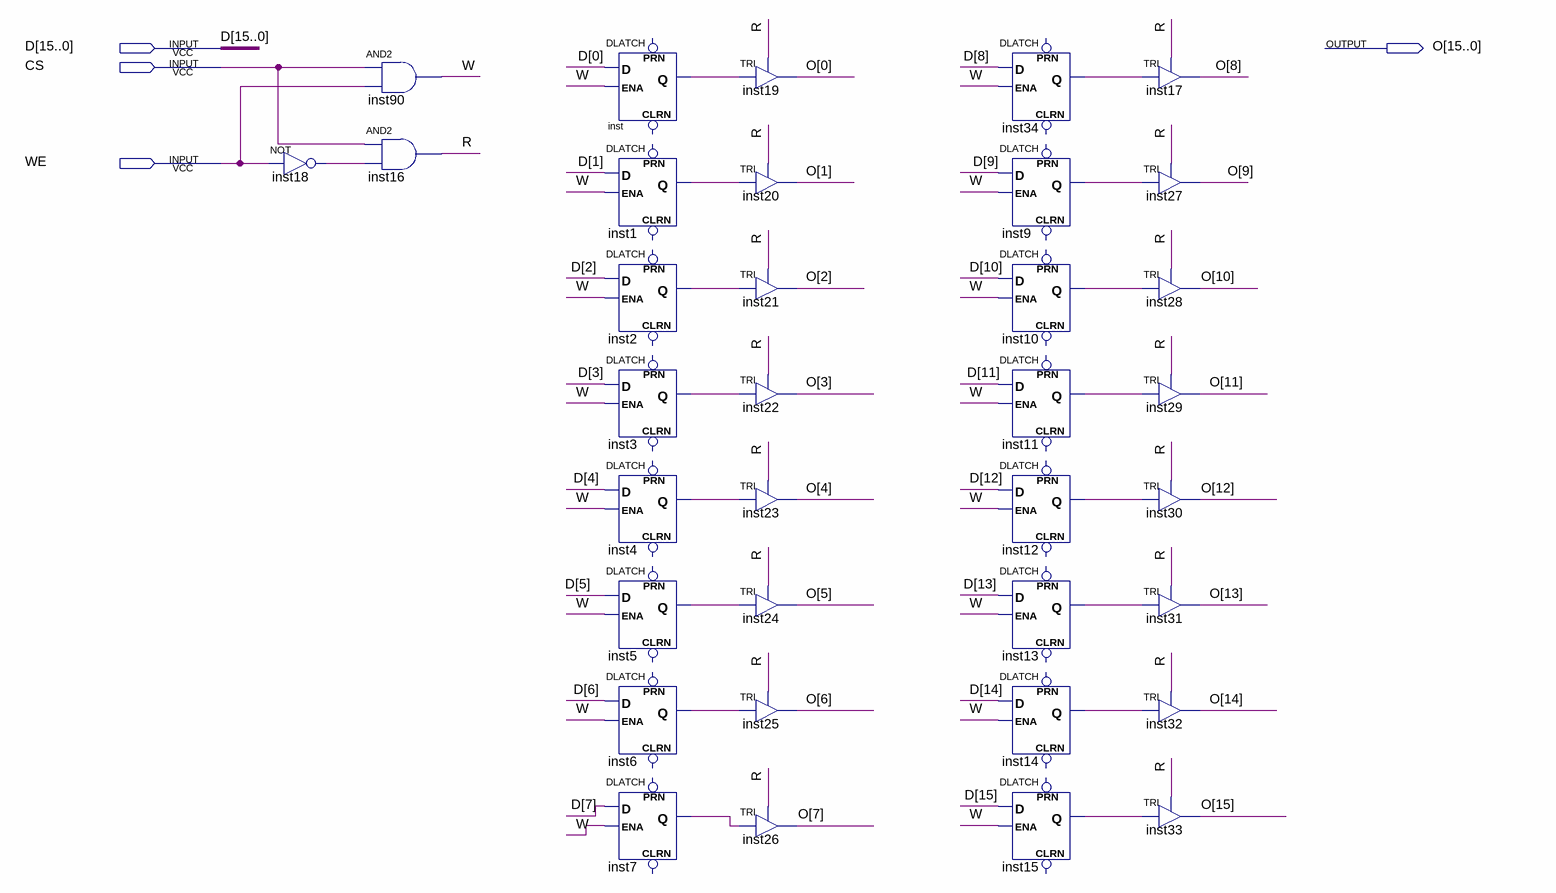
[diagram p0: schematic sheet]
// Quartus schematic Word16bit.bdf as structural Verilog: 35 symbols, 4 pins
module Word16bit (
  input  [15:0] D,
  input  CS,
  input  WE,
  output [15:0] O
);

  wire inst1_q, inst2_q, inst3_q, inst4_q, inst5_q, inst6_q, inst7_q, inst9_q, inst10_q, inst11_q, inst12_q,
       inst13_q, inst14_q, inst15_q, inst18_out, inst34_q, inst_q, R, W;

  not inst18 (inst18_out, WE);
  and inst90 (W, CS, WE);
  and inst16 (R, CS, inst18_out);
  DLATCH inst (.D(D[0]), .ENA(W), .Q(inst_q));  // open: CLRN, PRN
  DLATCH inst1 (.D(D[1]), .ENA(W), .Q(inst1_q));  // open: CLRN, PRN
  DLATCH inst2 (.D(D[2]), .ENA(W), .Q(inst2_q));  // open: CLRN, PRN
  DLATCH inst3 (.D(D[3]), .ENA(W), .Q(inst3_q));  // open: CLRN, PRN
  DLATCH inst4 (.D(D[4]), .ENA(W), .Q(inst4_q));  // open: CLRN, PRN
  DLATCH inst5 (.D(D[5]), .ENA(W), .Q(inst5_q));  // open: CLRN, PRN
  DLATCH inst6 (.D(D[6]), .ENA(W), .Q(inst6_q));  // open: CLRN, PRN
  DLATCH inst7 (.D(D[7]), .ENA(W), .Q(inst7_q));  // open: CLRN, PRN
  TRI inst19 (.IN(inst_q), .OE(R), .OUT(O[0]));
  TRI inst20 (.IN(inst1_q), .OE(R), .OUT(O[1]));
  TRI inst21 (.IN(inst2_q), .OE(R), .OUT(O[2]));
  TRI inst22 (.IN(inst3_q), .OE(R), .OUT(O[3]));
  TRI inst23 (.IN(inst4_q), .OE(R), .OUT(O[4]));
  TRI inst24 (.IN(inst5_q), .OE(R), .OUT(O[5]));
  TRI inst25 (.IN(inst6_q), .OE(R), .OUT(O[6]));
  TRI inst26 (.IN(inst7_q), .OE(R), .OUT(O[7]));
  DLATCH inst34 (.D(D[8]), .ENA(W), .Q(inst34_q));  // open: CLRN, PRN
  DLATCH inst9 (.D(D[9]), .ENA(W), .Q(inst9_q));  // open: CLRN, PRN
  DLATCH inst10 (.D(D[10]), .ENA(W), .Q(inst10_q));  // open: CLRN, PRN
  DLATCH inst11 (.D(D[11]), .ENA(W), .Q(inst11_q));  // open: CLRN, PRN
  DLATCH inst12 (.D(D[12]), .ENA(W), .Q(inst12_q));  // open: CLRN, PRN
  DLATCH inst13 (.D(D[13]), .ENA(W), .Q(inst13_q));  // open: CLRN, PRN
  DLATCH inst14 (.D(D[14]), .ENA(W), .Q(inst14_q));  // open: CLRN, PRN
  DLATCH inst15 (.D(D[15]), .ENA(W), .Q(inst15_q));  // open: CLRN, PRN
  TRI inst17 (.IN(inst34_q), .OE(R), .OUT(O[8]));
  TRI inst27 (.IN(inst9_q), .OE(R), .OUT(O[9]));
  TRI inst28 (.IN(inst10_q), .OE(R), .OUT(O[10]));
  TRI inst29 (.IN(inst11_q), .OE(R), .OUT(O[11]));
  TRI inst30 (.IN(inst12_q), .OE(R), .OUT(O[12]));
  TRI inst31 (.IN(inst13_q), .OE(R), .OUT(O[13]));
  TRI inst32 (.IN(inst14_q), .OE(R), .OUT(O[14]));
  TRI inst33 (.IN(inst15_q), .OE(R), .OUT(O[15]));
endmodule
